# EasyEDA Pro project ESP32dj.eprj

# Schematic Schematic1
Board Name: Board1; Create Date: 2025-04-11; Page Name: P1; Project Name: ESP32dj; Schematic Name: Schematic1; Update Date: 2025-04-11; Company: 嘉立创EDA; Page Size: A4; Version: V1.0
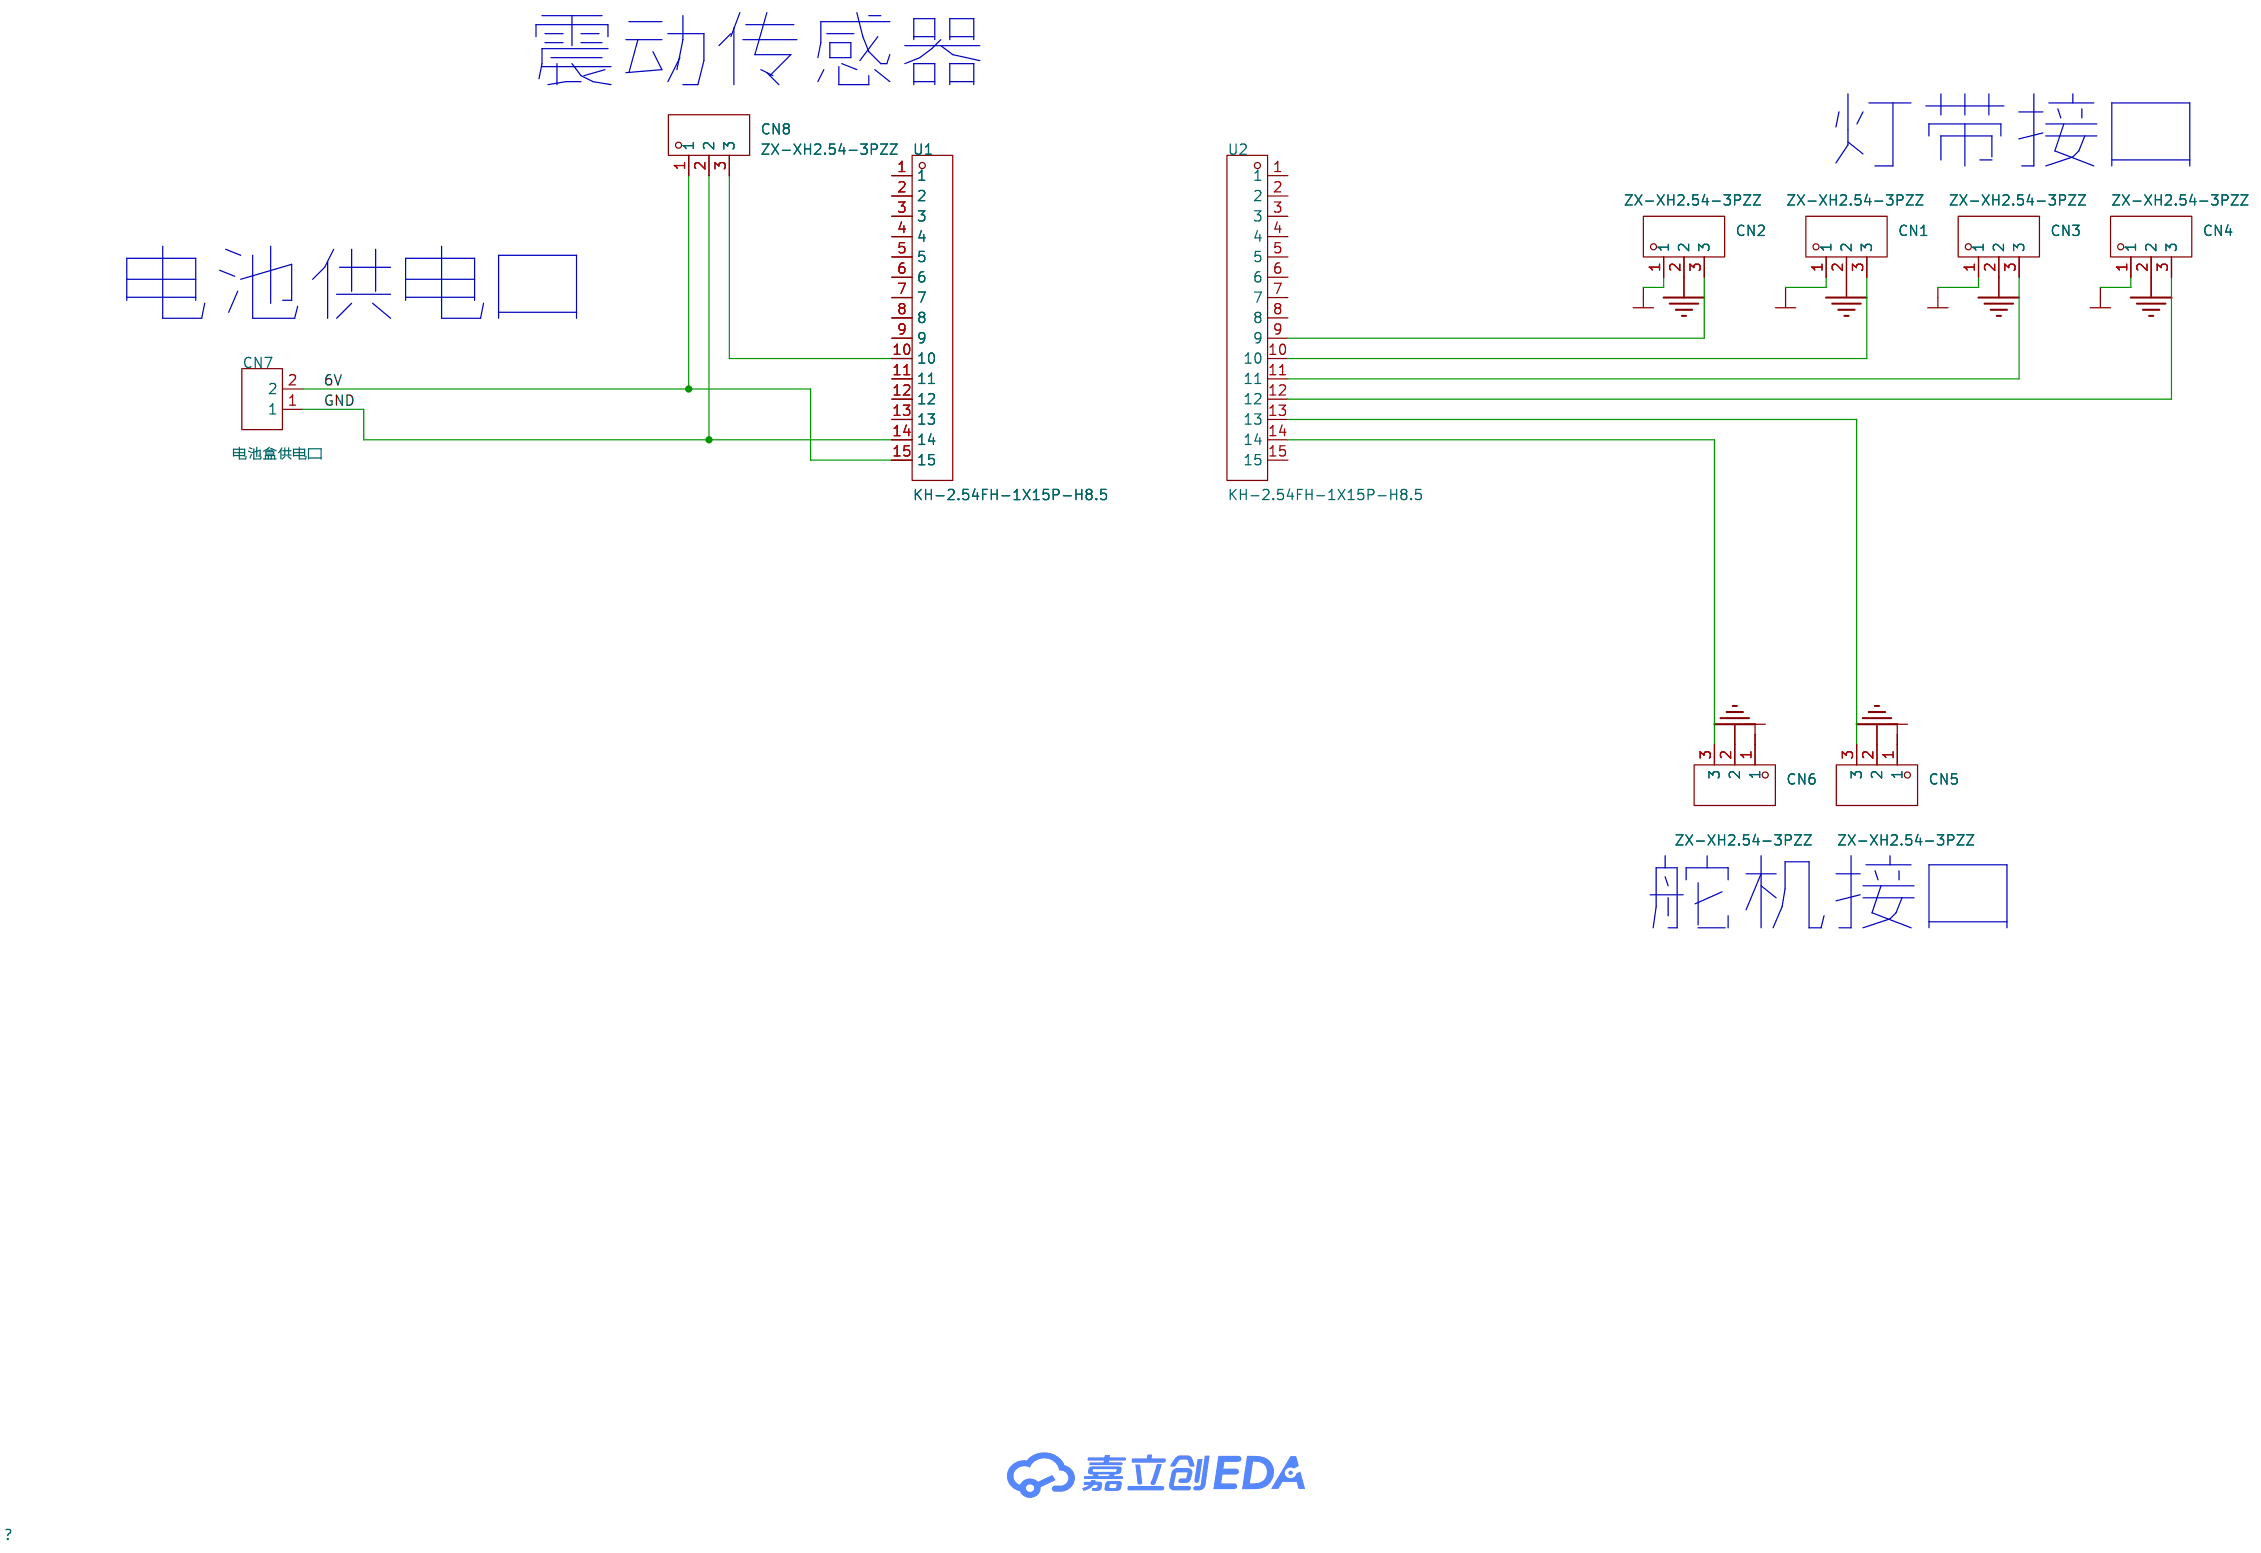
[diagram p0: schematic sheet]

## Parts
CN1  ZX-XH2.54-3PZZ  [CONN-TH_3P-P2.54_2501S-3P]
CN2  ZX-XH2.54-3PZZ  [CONN-TH_3P-P2.54_2501S-3P]
CN3  ZX-XH2.54-3PZZ  [CONN-TH_3P-P2.54_2501S-3P]
CN4  ZX-XH2.54-3PZZ  [CONN-TH_3P-P2.54_2501S-3P]
CN5  ZX-XH2.54-3PZZ  [CONN-TH_3P-P2.54_2501S-3P]
CN6  ZX-XH2.54-3PZZ  [CONN-TH_3P-P2.54_2501S-3P]
CN7  电池盒供电口  [CONN-TH_2P-P2.50_BX-XH2.54-2PZZ]
CN8  ZX-XH2.54-3PZZ  [CONN-TH_3P-P2.54_2501S-3P]
U1  KH-2.54FH-1X15P-H8.5  [HDR-TH_15P-P2.54-V-F]
U2  KH-2.54FH-1X15P-H8.5  [HDR-TH_15P-P2.54-V-F]

## Library data of the parts
CN1-CN6 CN8 = ZX-XH2.54-3PZZ: 插针结构:1x3P;间距:2.5mm;安装方式:直插;参考系列:XH;总PIN数:3P;排数:1;每排PIN数:3;行距:-;额定电流:3A;触头材质:黄铜;触头镀层:锡;工作温度范围:-25℃~+85℃;; LCSC Part Name: 1x3P 间距:2.5mm 直插 系列:XH; Supplier Part: C7429633; Manufacturer: Megastar(兆星); Supplier Footprint: 插件,P=2.5mm; JLCPCB Part Class: 扩展库; Datasheet: https://atta.szlcsc.com/upload/public/pdf/source/20230619/AE17037A2CFDBE8D9CBA775D61AD0A84.pdf; Supplier: LCSC; Pins Structure: 1x3P; Pitch: 2.5mm; Mounting Type: 直插; Reference Series: XH; Number of Pins: 3P; Number of Rows: 1; Number of PINs Per Row: 3; Rated Current: 3A; Contact Material: 黄铜; Contact Plating: 锡; Operating Temperature: -25℃~+85℃; Rated Voltage (Max): 250V; Plastic Material: PA66; Flame Retardant Rating: UL94V-0; Color: 白色; Z-Height of the Board: 7mm; X-Length of Bottom Edge on Board (Spacing Line): 10mm; Y-Width of Bottom Edge on Board: 5.9mm
CN7 = BX-XH2.54-2PZZ: 插针结构:1x2P;间距:2.5mm;安装方式:直插;参考系列:XH;总PIN数:2P;排数:1;每排PIN数:2;行距:-;额定电流:3A;触头材质:黄铜;触头镀层:锡;工作温度:-25℃~+85℃;; LCSC Part Name: 1x2P 间距:2.5mm 直插 系列:XH; Supplier Part: C18077833; Manufacturer: Bossie(博锡); Supplier Footprint: 插件,P=2.54mm; JLCPCB Part Class: 扩展库; Datasheet: https://atta.szlcsc.com/upload/public/pdf/source/20231017/CB25E46A13930659CD6CDE2F2553A508.pdf; Supplier: LCSC; Pins Structure: 1x2P; Pitch: 2.5mm; Mounting Type: 直插; Reference Series: XH; Number of Pins: 2P; Number of Rows: 1; Number of PINs Per Row: 2; Current Rating: 3A; Contact Material: 黄铜; Contact Plating: 锡; Operating Temperature: -25℃~+85℃; Voltage Rating: 250V; Plastic Material: PA66; Flame Retardant Rating: UL94V-0; Color: 白色; Z-Height of the Board: 7mm; X-Length of Bottom Edge on Board (Spacing Line): 7.5mm; Y-Width of Bottom Edge on Board: 5.9mm
U1 U2 = KH-2.54FH-1X15P-H8.5: 插孔结构:1x15P;间距:2.54mm;行距:-;圆孔/方孔:方孔;安装类型:直插;排数:单排;总孔位数:15P;额定电流:3A;额定电压:-;插孔方向:顶部;塑高:8.5mm;工作温度范围:-40℃~+105℃;; LCSC Part Name: 间距:2.54mm 1x15P 直插; Supplier Part: C2932676; Manufacturer: kinghelm(金航标); Supplier Footprint: 插件,P=2.54mm; JLCPCB Part Class: 扩展库; Datasheet: https://atta.szlcsc.com/upload/public/pdf/source/20211220/977AA415CFA981E866620A80068F25CA.pdf; Supplier: LCSC; Holes Structure: 1x15P; Pitch: 2.54mm; Circular Hole / Square Hole: 方孔; Mounting Type: 直插; Number of Rows: 单排; Number of Holes: 15P; Current Rating (Max): 3A; Holes Direction: 顶部; Insulation Height: 8.5mm; Operating Temperature Range: -40℃~+105℃

## Nets
6V: CN1.1 CN2.1 CN3.1 CN4.1 CN5.1 CN6.1 CN7.2 CN8.1 U1.15
GND: CN1.2 CN2.2 CN3.2 CN4.2 CN5.2 CN6.2 CN7.1 CN8.2 U1.14
$1N777: CN6.3 U2.14
$1N780: CN5.3 U2.13
$1N788: CN2.3 U2.9
$1N791: CN1.3 U2.10
$1N794: CN3.3 U2.11
$1N797: CN4.3 U2.12
$1N889: CN8.3 U1.10

Not connected (* = marked no-connect by the designer): U1 1 2 3 4 5 6 7 8 9 11 12 13; U2 1 2 3 4 5 6 7 8 15

## Notes on the sheet
- 震动传感器
- 灯带接口
- 电池供电口
- 舵机接口

# Board PCB1
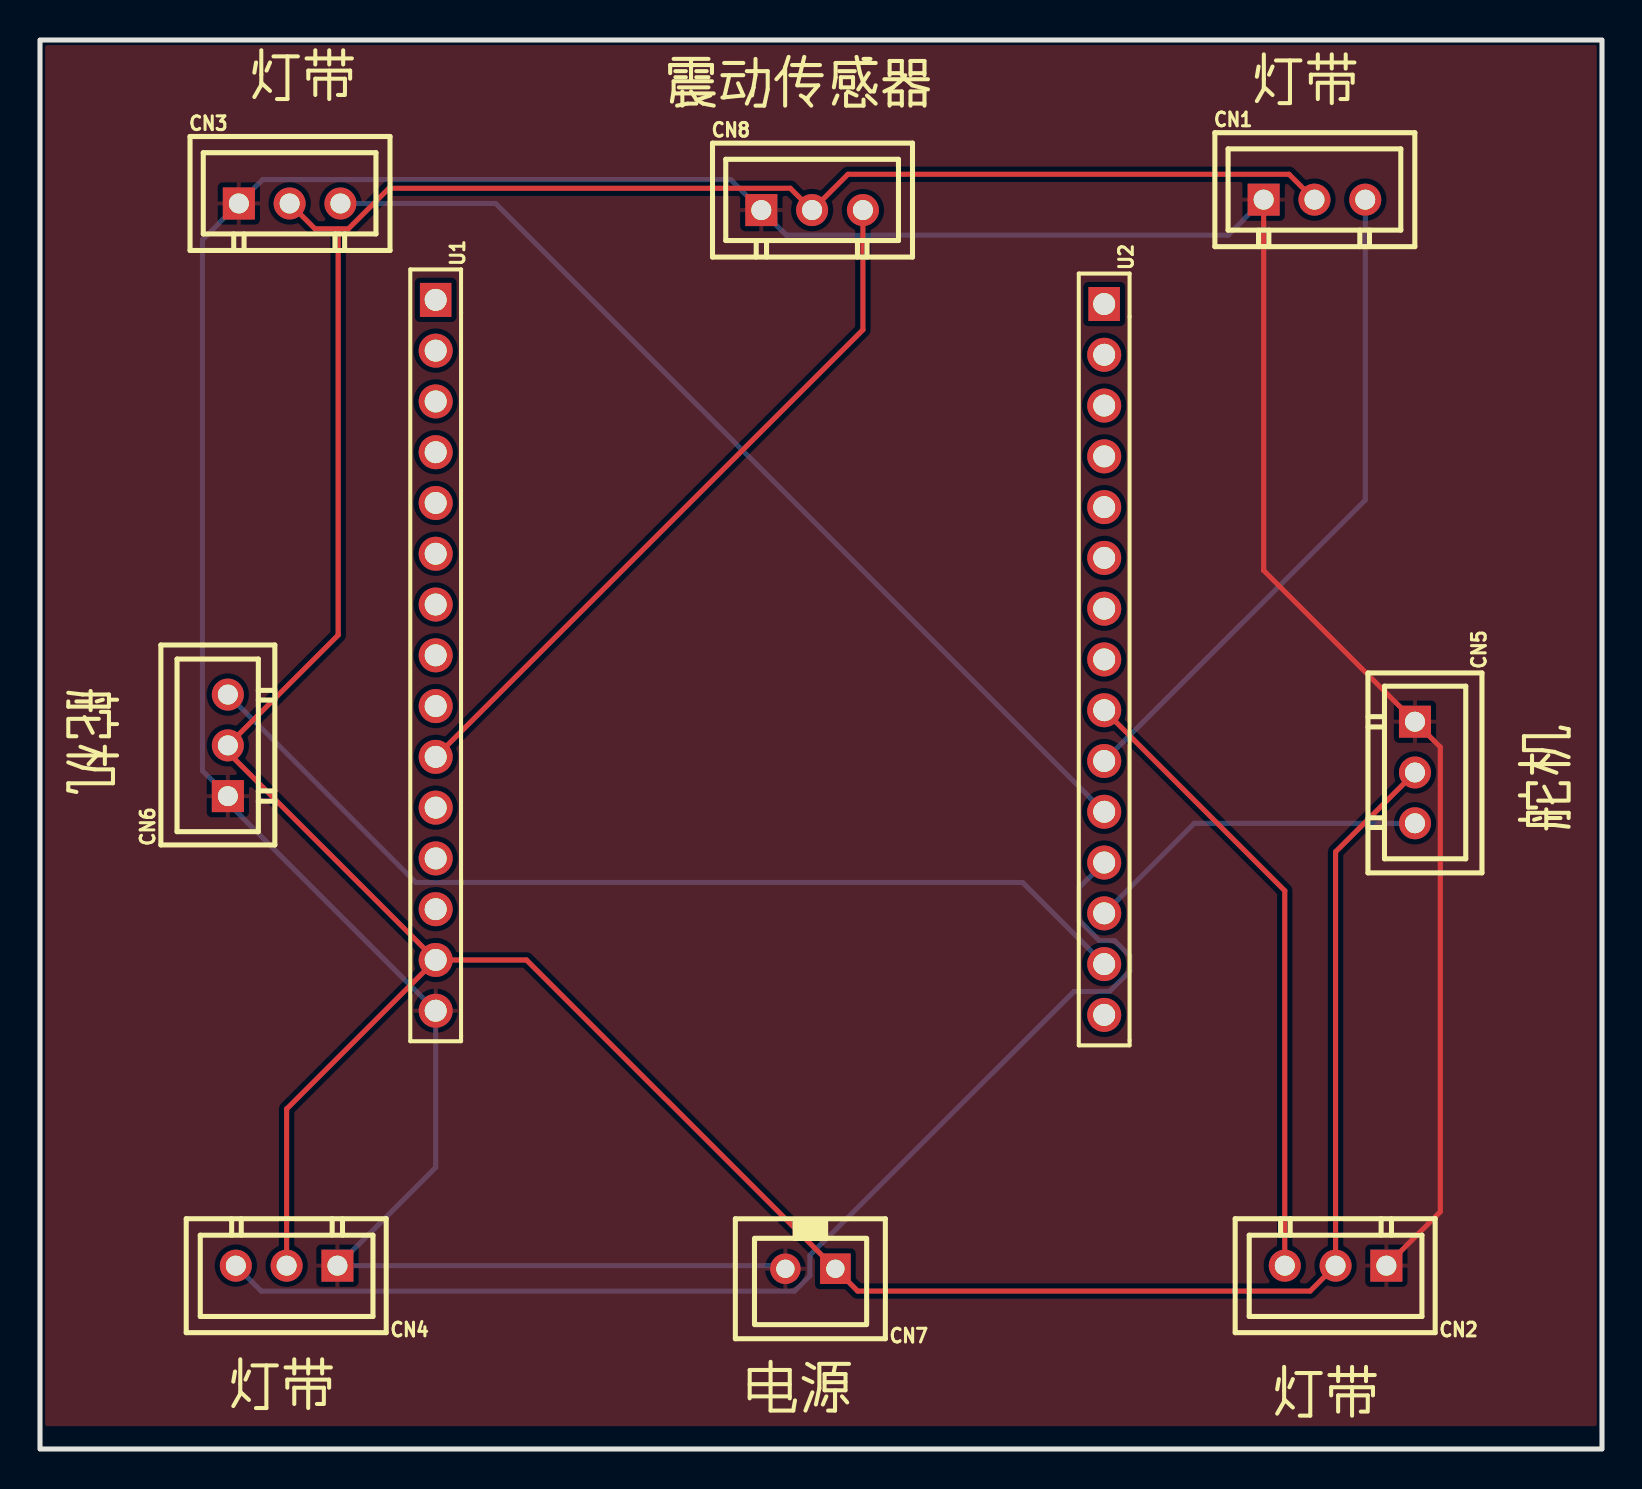
[diagram p1: board, top side]
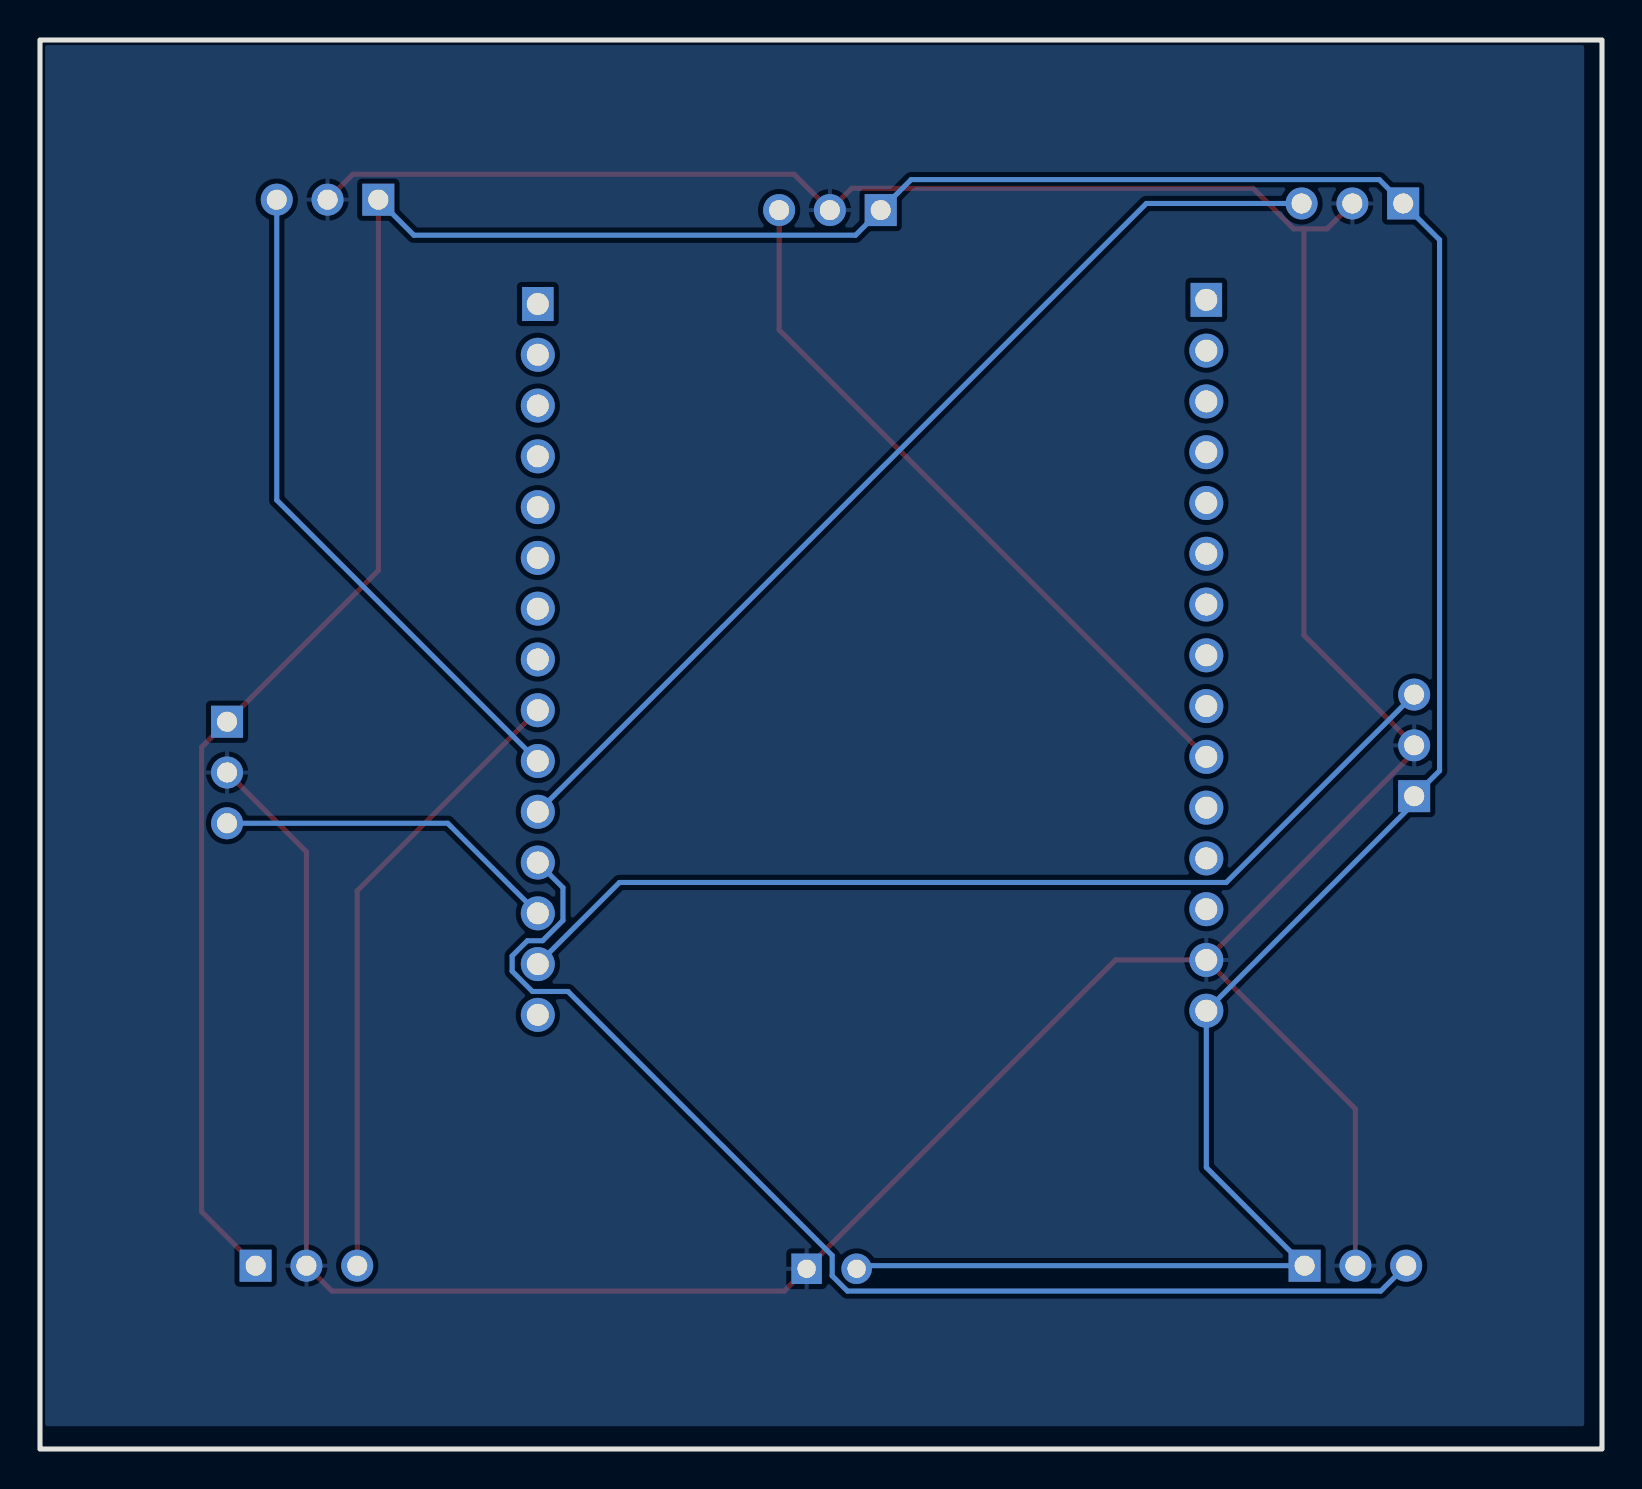
[diagram p2: board, bottom side, seen from below]

Outline 78.1 x 70.49 mm; copper layers: Top Layer, Bottom Layer. Coordinates in mm from the lower left corner of the outline.
Outline path: rectangle 0,70.49 78.1,0
Stack: Top Layer 0.035mm / Dielectric1 1.51mm FR4 er 4.5 / Bottom Layer 0.035mm

## Design rules (mm)
template: JLCPCB Capability(Two Layers Board)
spacing copperThickness1oz (default): track to track 0.102, other pairs 0.152 to 0.3
spacing copperThickness2oz: track to track 0.203, other pairs 0.152 to 0.3
track width copperThickness1oz (default): min 0.127, default 0.254, max 2.54
track width copperThickness2oz: min 0.203, default 0.254, max 2.54
differential pair differentialPair (default): width min 0.127, default 0.254, max 2.54; gap min 0.152, default 0.152
via viaSize (default): diameter min 0.5, default 0.61, max 10; hole min 0.3, default 0.305, max 6.3

## Placement (name value [footprint] x y rotation side)
CN1  ZX-XH2.54-3PZZ  [CONN-TH_3P-P2.54_2501S-3P]  63.73 62.5 0 top
CN2  ZX-XH2.54-3PZZ  [CONN-TH_3P-P2.54_2501S-3P]  64.78 9.17 180 top
CN3  ZX-XH2.54-3PZZ  [CONN-TH_3P-P2.54_2501S-3P]  12.48 62.31 0 top
CN4  ZX-XH2.54-3PZZ  [CONN-TH_3P-P2.54_2501S-3P]  12.33 9.17 180 top
CN5  ZX-XH2.54-3PZZ  [CONN-TH_3P-P2.54_2501S-3P]  68.75 33.84 270 top
CN6  ZX-XH2.54-3PZZ  [CONN-TH_3P-P2.54_2501S-3P]  9.39 35.2 90 top
CN7  电池盒供电口  [CONN-TH_2P-P2.50_BX-XH2.54-2PZZ]  38.52 9.02 180 top
CN8  ZX-XH2.54-3PZZ  [CONN-TH_3P-P2.54_2501S-3P]  38.61 61.98 0 top
U1  KH-2.54FH-1X15P-H8.5  [HDR-TH_15P-P2.54-V-F]  19.79 39.7 270 top
U2  KH-2.54FH-1X15P-H8.5  [HDR-TH_15P-P2.54-V-F]  53.21 39.5 270 top

## Footprints (pads in the part's own frame, mm; a bottom-side part is the same pattern mirrored in y, then rotated)
CONN-TH_2P-P2.50_BX-XH2.54-2PZZ
  rect 1.524x1.524 hole 0.914: 1(-1.25,0)
  round 1.524 hole 0.914: 2(1.25,0)
CONN-TH_3P-P2.54_2501S-3P
  rect 1.6x1.6 hole 1: 1(-2.54,0)
  round 1.6 hole 1: 2(0,0) 3(2.54,0)
HDR-TH_15P-P2.54-V-F
  rect 1.7x1.575 hole 1.1: 1(-17.78,0)
  round 1.7 hole 1.1: 2(-15.24,0) 3(-12.7,0) 4(-10.16,0) 5(-7.62,0) 6(-5.08,0) 7(-2.54,0) 8(0,0) 9(2.54,0) 10(5.08,0) 11(7.62,0) 12(10.16,0) 13(12.7,0) 14(15.24,0) 15(17.78,0)

## Nets
As in the schematic.

Pads without a net: U1 1 2 3 4 5 6 7 8 9 11 12 13; U2 1 2 3 4 5 6 7 8 15

## Routing (per net, layer and track width the routed paths; a pad name or vN(x,y) marks a point on that pad's centre or on a via; arc(x,y) is an arc through that point)
6V: length 194.9
  Top Layer w0.254: CN2.1 70.02,11.87 70.02,35.11 CN5.1 61.19,43.95 CN1.1
  Bottom Layer w0.254: CN1.1 59.41,60.72 37.32,60.72 CN8.1 34.54,63.5 11.14,63.5 CN3.1 8.12,60.49 8.12,33.93 CN6.1 9.39,32.32 U1.15 19.79,14.09 CN4.1 37.12,9.17 CN7.2
GND: length 194.6
  Top Layer w0.254: 14.91,61.04 13.75,61.04 12.48,62.31 ; 14.91,61.04 15.42,61.04 17.45,63.07 37.52,63.07 CN8.2 40.4,63.77 62.46,63.77 CN1.2 ; 14.91,61.04 14.91,40.72 CN6.2 9.39,34.86 U1.14 ; CN4.2 12.33,17.01 U1.14 ; CN5.2 64.78,29.87 CN2.2 63.51,7.9 40.89,7.9 CN7.1 24.32,24.46 U1.14
$1N777: length 49.4
  Bottom Layer w0.254: CN6.3 18.79,28.34 49.13,28.34 U2.14
$1N780: length 17.4
  Bottom Layer w0.254: U2.13 57.72,31.3 CN5.3
$1N788: length 31.5
  Top Layer w0.254: CN2.3 62.24,27.93 U2.9
$1N791: length 33.5
  Bottom Layer w0.254: CN1.3 66.27,47.47 U2.10
$1N794: length 50.8
  Bottom Layer w0.254: 15.02,62.31 22.78,62.31 U2.11
$1N797: length 59.9
  Bottom Layer w0.254: U2.12 51.96,28.08 51.96,26.44 52.97,25.43 53.73,25.43 54.5,24.67 54.5,23.9 53.48,22.89 51.7,22.89 38.49,9.68 38.49,8.66 37.73,7.9 11.06,7.9 CN4.3
$1N889: length 36.2
  Top Layer w0.254: U1.10 41.15,55.99 CN8.3

## Copper pours and planes (outline as drawn; the poured copper is in the pictures)
6V on Top Layer: -0.25,70.36 77.85,70.36 77.85,1.14 -0.25,1.14
GND on Bottom Layer: 0.89,70.49 78.36,70.49 78.36,1.14 0.89,1.14

## Text on the board
Top Silkscreen Layer: 震动传感器 | 舵机 | 灯带 | 电源
